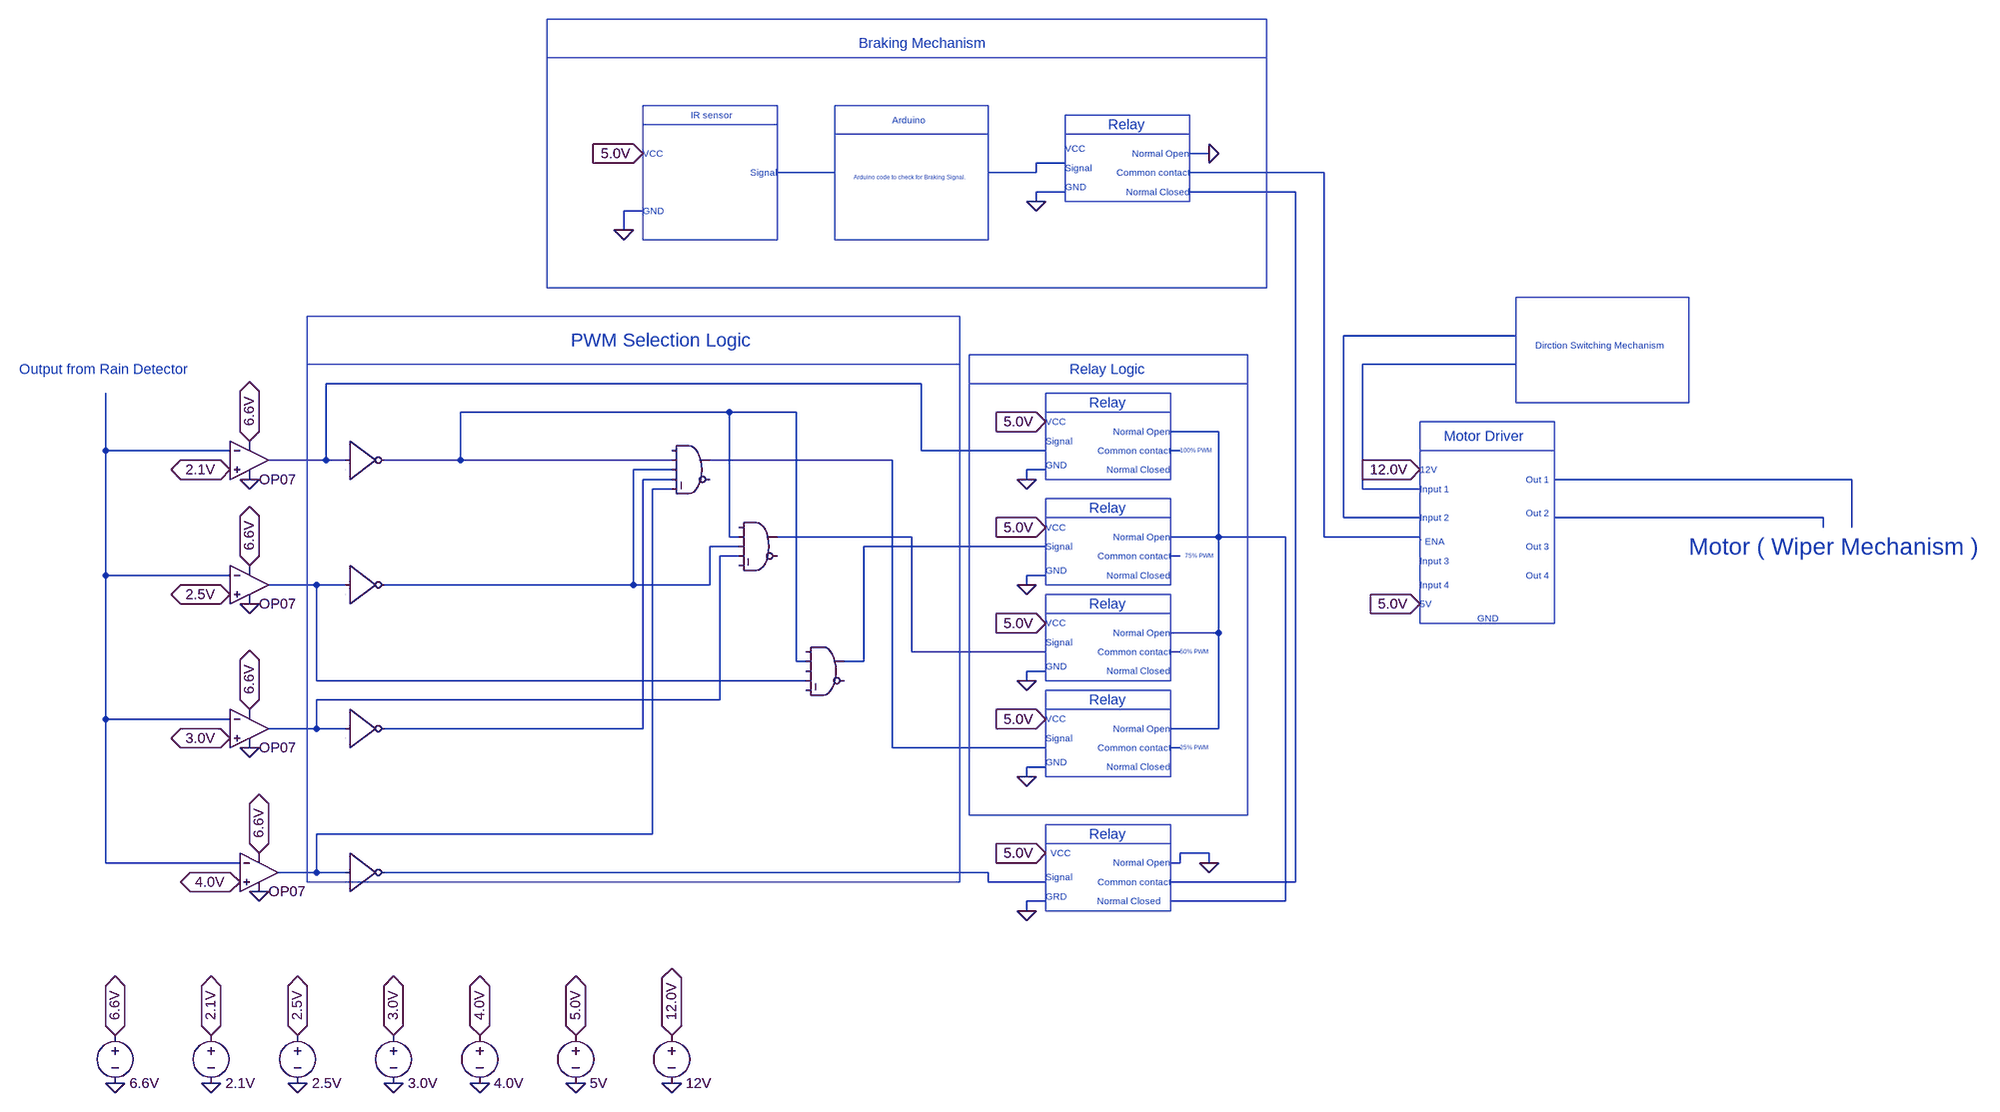
[diagram p0: schematic PWM_Selector.asc]
PWM_Selector.asc, the LTspice schematic file:
Version 4
SHEET 1 3104 1368
WIRE 1776 -352 1744 -352
WIRE 1536 -336 1488 -336
WIRE 1152 -320 1056 -320
WIRE 1488 -320 1488 -336
WIRE 1488 -320 1408 -320
WIRE 1968 -320 1744 -320
WIRE 1536 -288 1488 -288
WIRE 1920 -288 1744 -288
WIRE 1488 -272 1488 -288
WIRE 832 -256 800 -256
WIRE 800 -224 800 -256
WIRE 2288 -48 2000 -48
WIRE 2288 0 2032 0
WIRE 1296 32 304 32
WIRE 976 80 528 80
WIRE 1088 80 976 80
WIRE 1792 112 1712 112
WIRE -64 144 -64 48
WIRE 144 144 -64 144
WIRE 1296 144 1296 32
WIRE 1504 144 1296 144
WIRE 1728 144 1712 144
WIRE 304 160 304 32
WIRE 304 160 208 160
WIRE 336 160 304 160
WIRE 528 160 528 80
WIRE 528 160 400 160
WIRE 880 160 528 160
WIRE 1248 160 944 160
WIRE 880 176 816 176
WIRE 1504 176 1472 176
WIRE 880 192 832 192
WIRE 1472 192 1472 176
WIRE 2848 192 2352 192
WIRE 880 208 848 208
WIRE 2032 208 2032 0
WIRE 2128 208 2032 208
WIRE 2000 256 2000 -48
WIRE 2128 256 2000 256
WIRE 2800 256 2352 256
WIRE 2800 272 2800 256
WIRE 2848 272 2848 192
WIRE 976 288 976 80
WIRE 992 288 976 288
WIRE 1280 288 1056 288
WIRE 1792 288 1792 112
WIRE 1792 288 1712 288
WIRE 1904 288 1792 288
WIRE 1968 288 1968 -320
WIRE 2128 288 1968 288
WIRE 992 304 944 304
WIRE 1504 304 1200 304
WIRE 992 320 960 320
WIRE 1728 320 1712 320
WIRE -64 352 -64 144
WIRE 144 352 -64 352
WIRE 1504 352 1472 352
WIRE 288 368 208 368
WIRE 336 368 288 368
WIRE 816 368 816 176
WIRE 816 368 400 368
WIRE 944 368 944 304
WIRE 944 368 816 368
WIRE 1472 368 1472 352
WIRE 1792 448 1792 288
WIRE 1792 448 1712 448
WIRE 1280 480 1280 288
WIRE 1504 480 1280 480
WIRE 1728 480 1712 480
WIRE 1088 496 1088 80
WIRE 1104 496 1088 496
WIRE 1200 496 1200 304
WIRE 1200 496 1168 496
WIRE 1504 512 1472 512
WIRE 288 528 288 368
WIRE 1104 528 288 528
WIRE 1472 528 1472 512
WIRE 960 560 960 320
WIRE 960 560 288 560
WIRE -64 592 -64 352
WIRE 144 592 -64 592
WIRE 288 608 288 560
WIRE 288 608 208 608
WIRE 336 608 288 608
WIRE 832 608 832 192
WIRE 832 608 400 608
WIRE 1792 608 1792 448
WIRE 1792 608 1712 608
WIRE 1248 640 1248 160
WIRE 1504 640 1248 640
WIRE 1728 640 1712 640
WIRE 1504 672 1472 672
WIRE 1472 688 1472 672
WIRE 848 784 848 208
WIRE 848 784 288 784
WIRE 1776 816 1728 816
WIRE -64 832 -64 592
WIRE 160 832 -64 832
WIRE 1728 832 1728 816
WIRE 1728 832 1712 832
WIRE 1776 832 1776 816
WIRE 288 848 288 784
WIRE 288 848 224 848
WIRE 336 848 288 848
WIRE 1408 848 400 848
WIRE 1408 864 1408 848
WIRE 1504 864 1408 864
WIRE 1920 864 1920 -288
WIRE 1920 864 1712 864
WIRE 1504 896 1472 896
WIRE 1904 896 1904 288
WIRE 1904 896 1712 896
WIRE 1472 912 1472 896
FLAG 176 192 0
FLAG 176 400 0
FLAG 176 640 0
FLAG 192 880 0
FLAG 112 1200 0
FLAG 256 1200 0
FLAG 416 1200 0
FLAG 560 1200 0
FLAG 112 1120 2.1V
IOPIN 112 1120 BiDir
FLAG 144 176 2.1V
IOPIN 144 176 BiDir
FLAG 256 1120 2.5V
IOPIN 256 1120 BiDir
FLAG 144 384 2.5V
IOPIN 144 384 BiDir
FLAG 416 1120 3.0V
IOPIN 416 1120 BiDir
FLAG 144 624 3.0V
IOPIN 144 624 BiDir
FLAG 560 1120 4.0V
IOPIN 560 1120 BiDir
FLAG 160 864 4.0V
IOPIN 160 864 BiDir
FLAG -48 1120 6.6V
IOPIN -48 1120 BiDir
FLAG 176 128 6.6V
IOPIN 176 128 BiDir
FLAG 176 336 6.6V
IOPIN 176 336 BiDir
FLAG 176 576 6.6V
IOPIN 176 576 BiDir
FLAG 192 816 6.6V
IOPIN 192 816 BiDir
FLAG 720 1200 0
FLAG 720 1120 5.0V
IOPIN 720 1120 BiDir
FLAG 1472 192 0
FLAG 1472 912 0
FLAG 1776 832 0
FLAG 1488 -272 0
FLAG 880 1200 0
FLAG 880 1120 12.0V
IOPIN 880 1120 BiDir
FLAG 800 -224 0
FLAG 832 -352 5.0V
IOPIN 832 -352 In
FLAG 1504 96 5.0V
IOPIN 1504 96 In
FLAG 1472 368 0
FLAG 1504 272 5.0V
IOPIN 1504 272 In
FLAG 1472 528 0
FLAG 1504 432 5.0V
IOPIN 1504 432 In
FLAG 1472 688 0
FLAG 1504 592 5.0V
IOPIN 1504 592 In
FLAG 1504 816 5.0V
IOPIN 1504 816 In
FLAG 2128 176 12.0V
IOPIN 2128 176 In
FLAG 2128 400 5.0V
IOPIN 2128 400 In
FLAG -48 1200 0
FLAG 1776 -352 0
SYMBOL OpAmps\\OP07 176 96 R0
WINDOW 0 16 32 Invisible 2
SYMATTR InstName U1
SYMBOL OpAmps\\OP07 176 304 R0
WINDOW 0 16 32 Invisible 2
SYMATTR InstName U2
SYMBOL OpAmps\\OP07 176 544 R0
WINDOW 0 16 32 Invisible 2
SYMATTR InstName U3
SYMBOL OpAmps\\OP07 192 784 R0
WINDOW 0 16 32 Invisible 2
SYMATTR InstName U4
SYMBOL voltage 112 1104 R0
WINDOW 123 0 0 Left 0
WINDOW 39 0 0 Left 0
WINDOW 0 24 16 Invisible 2
SYMATTR InstName V1
SYMATTR Value 2.1V
SYMBOL voltage 256 1104 R0
WINDOW 123 0 0 Left 0
WINDOW 39 0 0 Left 0
WINDOW 0 24 16 Invisible 2
SYMATTR InstName V2
SYMATTR Value 2.5V
SYMBOL voltage 416 1104 R0
WINDOW 123 0 0 Left 0
WINDOW 39 0 0 Left 0
WINDOW 0 24 16 Invisible 2
SYMATTR InstName V3
SYMATTR Value 3.0V
SYMBOL voltage 560 1104 R0
WINDOW 123 0 0 Left 0
WINDOW 39 0 0 Left 0
WINDOW 0 24 16 Invisible 2
SYMATTR InstName V4
SYMATTR Value 4.0V
SYMBOL voltage -48 1104 R0
WINDOW 123 0 0 Left 0
WINDOW 39 0 0 Left 0
WINDOW 0 24 16 Invisible 2
SYMATTR InstName V5
SYMATTR Value 6.6V
SYMBOL voltage 720 1104 R0
WINDOW 123 0 0 Left 0
WINDOW 39 0 0 Left 0
WINDOW 0 24 16 Invisible 2
SYMATTR InstName V6
SYMATTR Value 5V
SYMBOL Digital\\inv 336 96 R0
WINDOW 0 8 32 Invisible 2
SYMATTR InstName A7
SYMBOL Digital\\inv 336 304 R0
WINDOW 0 8 32 Invisible 2
SYMATTR InstName A8
SYMBOL Digital\\inv 336 544 R0
WINDOW 0 8 32 Invisible 2
SYMATTR InstName A9
SYMBOL Digital\\inv 336 784 R0
WINDOW 0 8 32 Invisible 2
SYMATTR InstName A10
SYMBOL voltage 880 1104 R0
WINDOW 0 24 16 Invisible 2
WINDOW 123 0 0 Left 0
WINDOW 39 0 0 Left 0
SYMATTR InstName V7
SYMATTR Value 12V
SYMBOL Digital\\and 912 112 R0
WINDOW 0 16 24 Invisible 2
SYMATTR InstName A1
SYMBOL Digital\\and 1024 240 R0
WINDOW 0 16 24 Invisible 2
SYMATTR InstName A2
SYMBOL Digital\\and 1136 448 R0
WINDOW 0 16 24 Invisible 2
SYMATTR InstName A3
TEXT -208 8 Left 2 ;Output from Rain Detector
TEXT 1544 8 Left 2 ;Relay Logic
TEXT 2168 120 Left 2 ;Motor Driver
TEXT 2128 288 Left 1 ;.
TEXT 1576 64 Left 2 ;Relay
TEXT 1504 96 Left 1 ;VCC
TEXT 1504 128 Left 1 ;Signal
TEXT 1504 168 Left 1 ;GND
TEXT 1712 112 Right 1 ;Normal Open
TEXT 1712 176 Right 1 ;Normal Closed
TEXT 1712 144 Right 1 ;Common contact
TEXT 1728 144 Left 0 ;100% PWM
TEXT 2576 304 Left 4 ;Motor ( Wiper Mechanism )
TEXT 2136 296 Left 1 ;ENA
TEXT 2128 176 Left 1 ;12V
TEXT 2128 400 Left 1 ;5V
TEXT 2224 424 Left 1 ;GND
TEXT 2128 208 Left 1 ;Input 1
TEXT 2128 256 Left 1 ;Input 2
TEXT 2128 328 Left 1 ;Input 3
TEXT 2128 368 Left 1 ;Input 4
TEXT 2344 192 Right 1 ;Out 1
TEXT 2344 248 Right 1 ;Out 2
TEXT 2344 304 Right 1 ;Out 3
TEXT 2344 352 Right 1 ;Out 4
TEXT 1576 784 Left 2 ;Relay
TEXT 1512 816 Left 1 ;VCC
TEXT 1504 856 Left 1 ;Signal
TEXT 1504 888 Left 1 ;GRD
TEXT 1712 832 Right 1 ;Normal Open
TEXT 1696 896 Right 1 ;Normal Closed
TEXT 1712 864 Right 1 ;Common contact
TEXT 1608 -400 Left 2 ;Relay
TEXT 1536 -360 Left 1 ;VCC
TEXT 1536 -328 Left 1 ;Signal
TEXT 1536 -296 Left 1 ;GND
TEXT 1744 -352 Right 1 ;Normal Open
TEXT 1744 -288 Right 1 ;Normal Closed
TEXT 1744 -320 Right 1 ;Common contact
TEXT 912 -416 Left 1 ;IR sensor
TEXT 1248 -408 Left 1 ;Arduino
TEXT 832 -352 Left 1 ;VCC
TEXT 1056 -320 Right 1 ;Signal
TEXT 832 -256 Left 1 ;GND
TEXT 1192 -536 Left 2 ;Braking Mechanism
TEXT 1184 -312 Left 0 ;Arduino code to check for Braking Signal.
TEXT 712 -40 Left 3 ;PWM Selection Logic
TEXT 1576 240 Left 2 ;Relay
TEXT 1504 272 Left 1 ;VCC
TEXT 1504 304 Left 1 ;Signal
TEXT 1504 344 Left 1 ;GND
TEXT 1712 288 Right 1 ;Normal Open
TEXT 1712 352 Right 1 ;Normal Closed
TEXT 1712 320 Right 1 ;Common contact
TEXT 1576 400 Left 2 ;Relay
TEXT 1504 432 Left 1 ;VCC
TEXT 1504 464 Left 1 ;Signal
TEXT 1504 504 Left 1 ;GND
TEXT 1712 448 Right 1 ;Normal Open
TEXT 1712 512 Right 1 ;Normal Closed
TEXT 1712 480 Right 1 ;Common contact
TEXT 1504 592 Left 1 ;VCC
TEXT 1504 624 Left 1 ;Signal
TEXT 1504 664 Left 1 ;GND
TEXT 1712 608 Right 1 ;Normal Open
TEXT 1712 672 Right 1 ;Normal Closed
TEXT 1712 640 Right 1 ;Common contact
TEXT 1576 560 Left 2 ;Relay
TEXT 1736 320 Left 0 ;75% PWM
TEXT 1728 480 Left 0 ;50% PWM
TEXT 1728 640 Left 0 ;25% PWM
TEXT 2320 -32 Left 1 ;Dirction Switching Mechanism
LINE Normal 1840 32 1376 32
LINE Normal 1840 32 1840 32 2
LINE Normal 1520 80 1520 80 2
LINE Normal 1520 800 1520 800 2
LINE Normal 1552 -384 1552 -384 2
LINE Normal 1520 256 1520 256 2
LINE Normal 1520 416 1520 416 2
LINE Normal 1520 576 1520 576 2
RECTANGLE Normal 1840 752 1376 -16
RECTANGLE Normal 2352 432 2128 144
RECTANGLE Normal 2352 96 2128 144
RECTANGLE Normal 1712 192 1504 48
RECTANGLE Normal 1712 80 1504 48
RECTANGLE Normal 1712 368 1504 224
RECTANGLE Normal 1712 256 1504 224
RECTANGLE Normal 1712 528 1504 384
RECTANGLE Normal 1712 416 1504 384 2
RECTANGLE Normal 1712 688 1504 544
RECTANGLE Normal 1712 576 1504 544
RECTANGLE Normal 1712 912 1504 768
RECTANGLE Normal 1712 800 1504 768
RECTANGLE Normal 1744 -272 1536 -416
RECTANGLE Normal 1744 -384 1536 -416
RECTANGLE Normal 1056 -208 832 -400
RECTANGLE Normal 1056 -432 832 -400
RECTANGLE Normal 1872 -128 672 -512
RECTANGLE Normal 1872 -576 672 -512
RECTANGLE Normal 1408 -208 1152 -432
RECTANGLE Normal 1408 -384 1152 -432
RECTANGLE Normal 1360 864 272 0
RECTANGLE Normal 1360 -80 272 0
RECTANGLE Normal 1712 368 1504 224
RECTANGLE Normal 1712 256 1504 224
RECTANGLE Normal 1712 528 1504 384
RECTANGLE Normal 1712 416 1504 384
RECTANGLE Normal 1712 528 1504 384
RECTANGLE Normal 1712 416 1504 384
RECTANGLE Normal 2576 64 2288 -112

The netlist it stands for:
* PWM_Selector.asc
XU1 2.1V N010 6.6V 0 N007 LT1001  ; OP07, pins In+ In- V+ V- OUT
XU2 2.5V N010 6.6V 0 N022 LT1001  ; OP07, pins In+ In- V+ V- OUT
XU3 3.0V N010 6.6V 0 N020 LT1001  ; OP07, pins In+ In- V+ V- OUT
XU4 4.0V N010 6.6V 0 N016 LT1001  ; OP07, pins In+ In- V+ V- OUT
V1 2.1V 0 2.1V
V2 2.5V 0 2.5V
V3 3.0V 0 3.0V
V4 4.0V 0 4.0V
V5 6.6V 0 6.6V
V6 5.0V 0 5V
A7 N007 0 0 0 0 N008 0 0 BUF
A8 N022 0 0 0 0 N013 0 0 BUF
A9 N020 0 0 0 0 N014 0 0 BUF
A10 N016 0 0 0 0 N025 0 0 BUF
V7 12.0V 0 12V
A1 0 N008 N013 N014 N016 0 N012 0 AND
A2 0 N008 N013 N020 0 0 N018 0 AND
A3 0 N008 0 N022 0 0 N019 0 AND
* Output from Rain Detector
* Relay Logic
* Motor Driver
* .
* Relay
* VCC
* Signal
* GND
* Normal Open
* Normal Closed
* Common contact
* 100% PWM
* Motor ( Wiper Mechanism )
* ENA
* 12V
* 5V
* GND
* Input 1
* Input 2
* Input 3
* Input 4
* Out 1
* Out 2
* Out 3
* Out 4
* Relay
* VCC
* Signal
* GRD
* Normal Open
* Normal Closed
* Common contact
* Relay
* VCC
* Signal
* GND
* Normal Open
* Normal Closed
* Common contact
* IR sensor
* Arduino
* VCC
* Signal
* GND
* Braking Mechanism
* Arduino code to check for Braking Signal.
* PWM Selection Logic
* Relay
* VCC
* Signal
* GND
* Normal Open
* Normal Closed
* Common contact
* Relay
* VCC
* Signal
* GND
* Normal Open
* Normal Closed
* Common contact
* VCC
* Signal
* GND
* Normal Open
* Normal Closed
* Common contact
* Relay
* 75% PWM
* 50% PWM
* 25% PWM
* Dirction Switching Mechanism
.lib LTC.lib
.backanno
.end